# EAGLE design Screen (EAGLE 8.4.1)
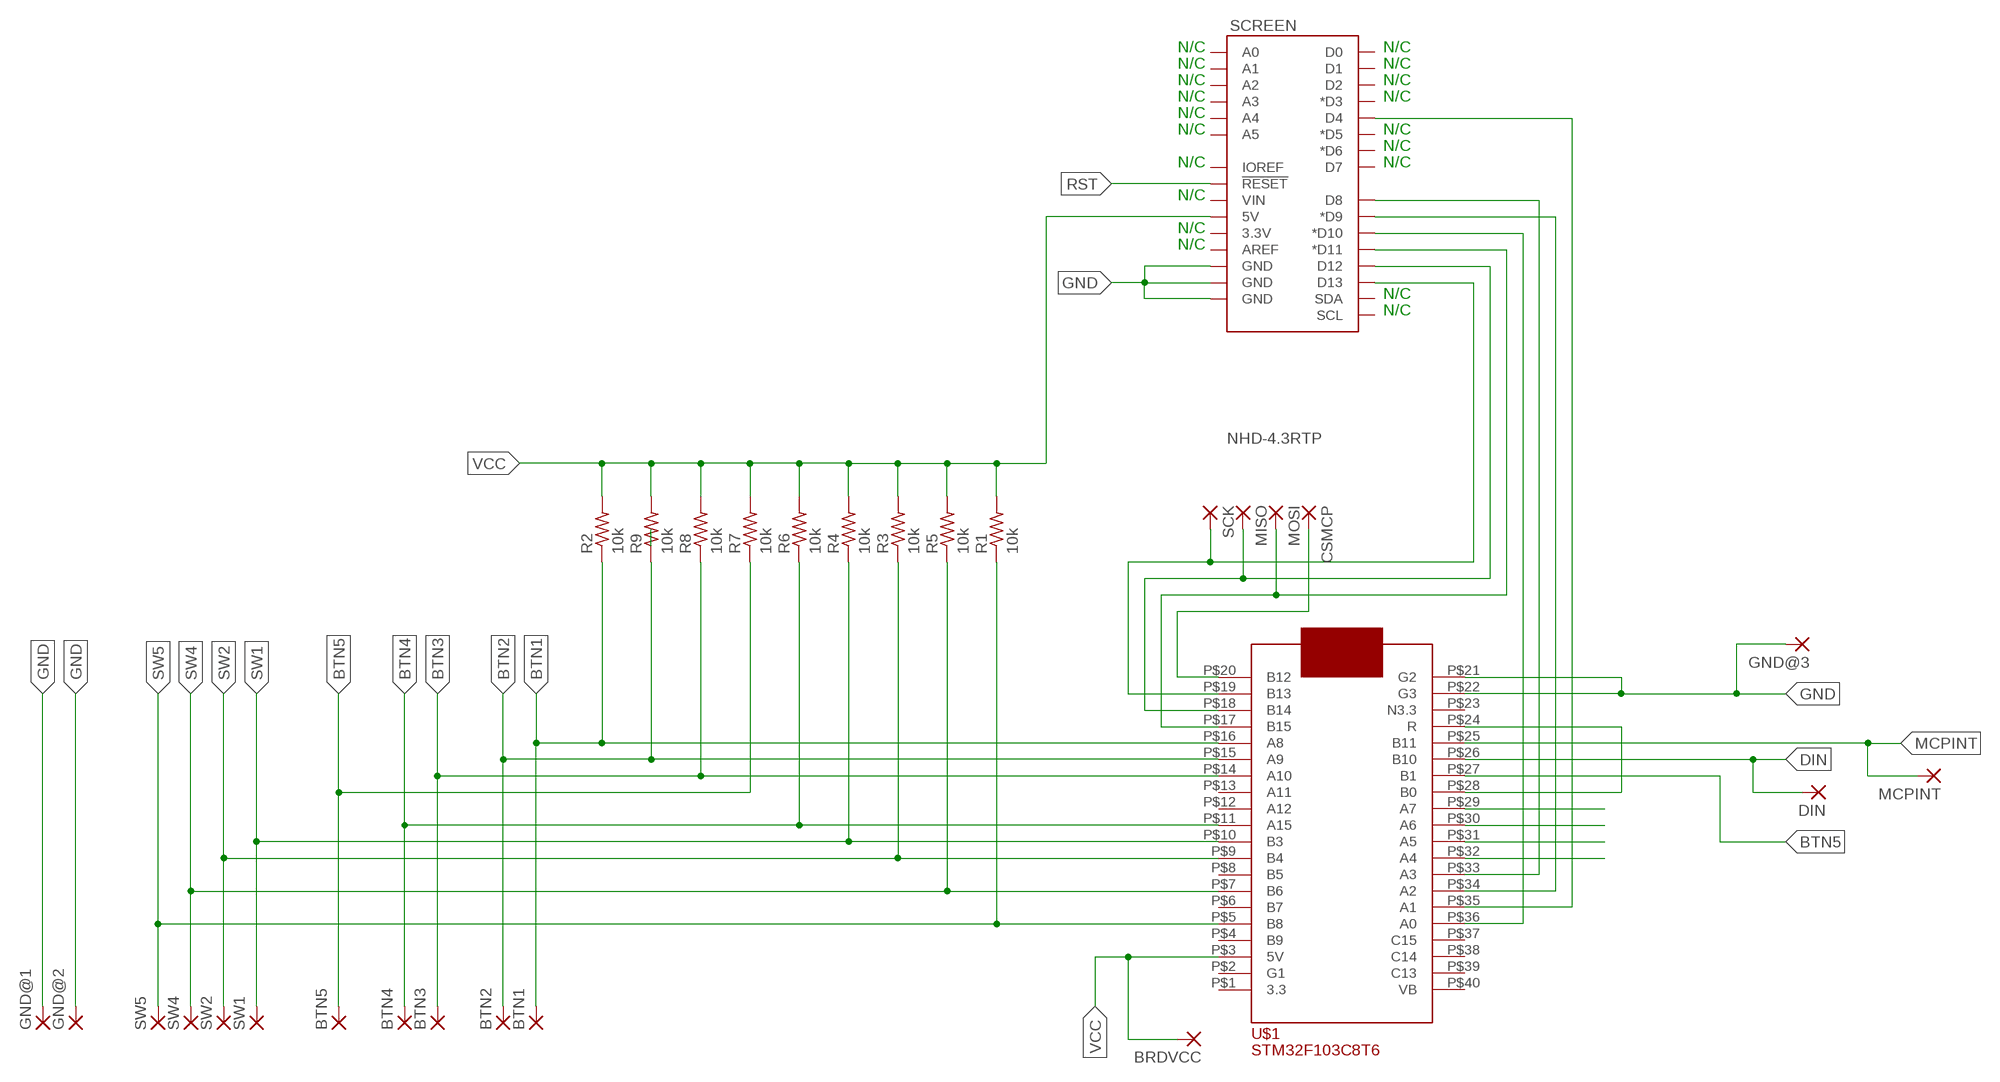
[diagram p0: schematic, sheet 1]

## Parts
BRDVCC  SMD5  [SMD2,54-5,08]
BTN1  SMD5  [SMD2,54-5,08]
BTN2  SMD5  [SMD2,54-5,08]
BTN3  SMD5  [SMD2,54-5,08]
BTN4  SMD5  [SMD2,54-5,08]
BTN5  SMD5  [SMD2,54-5,08]
CSMCP  SMD5  [SMD2,54-5,08]
DIN  SMD5  [SMD2,54-5,08]
GND@1  SMD5  [SMD2,54-5,08]
GND@2  SMD5  [SMD2,54-5,08]
GND@3  SMD5  [SMD2,54-5,08]
MCPINT  SMD5  [SMD2,54-5,08]
MISO  SMD5  [SMD2,54-5,08]
MOSI  SMD5  [SMD2,54-5,08]
R1  10k  0207/10  [0207/10]
R2  10k  0207/10  [0207/10]
R3  10k  0207/10  [0207/10]
R4  10k  0207/10  [0207/10]
R5  10k  0207/10  [0207/10]
R6  10k  0207/10  [0207/10]
R7  10k  0207/10  [0207/10]
R8  10k  0207/10  [0207/10]
R9  10k  0207/10  [0207/10]
SCK  SMD5  [SMD2,54-5,08]
SCREEN  NHD-4.3RTP  [NHD-4.3RTP]
SW1  SMD5  [SMD2,54-5,08]
SW2  SMD5  [SMD2,54-5,08]
SW4  SMD5  [SMD2,54-5,08]
SW5  SMD5  [SMD2,54-5,08]
U$1  STM32F103C8T6DIP40  [STM32]

## Nets
BTN1: BTN1.1(P) R2.1 U$1.P$16(A8)
BTN2: BTN2.1(P) R9.1 U$1.P$15(A9)
BTN3: BTN3.1(P) R8.1 U$1.P$14(A10)
BTN4: BTN4.1(P) R6.1 U$1.P$11(A15)
BTN5: BTN5.1(P) R7.1 U$1.P$27(B1)
CS_SCREEN: SCREEN.D10(*D10) U$1.P$36(A0)
CSMCP: CSMCP.1(P) U$1.P$20(B12)
DIN: DIN.1(P) U$1.P$26(B10)
GND: GND@1.1(P) GND@2.1(P) GND@3.1(P) SCREEN.GND@1(GND) SCREEN.GND@2(GND) SCREEN.GND@3(GND) U$1.P$21(G2) U$1.P$22(G3)
MCPINT: MCPINT.1(P) U$1.P$25(B11)
MISO: MISO.1(P) SCREEN.D12 U$1.P$18(B14)
MOSI: MOSI.1(P) SCREEN.D11(*D11) U$1.P$17(B15)
N$1: SCREEN.D4 U$1.P$35(A1)
N$2: SCREEN.D9(*D9) U$1.P$34(A2)
N$3: SCREEN.D8 U$1.P$33(A3)
N$9: U$1.P$29(A7)
N$10: U$1.P$30(A6)
N$11: U$1.P$31(A5)
N$12: U$1.P$32(A4)
N$13: U$1.P$24(R) U$1.P$28(B0)
RST: SCREEN.RESET@1(!RESET!)
SCK: SCK.1(P) SCREEN.D13 U$1.P$19(B13)
SW1: R4.1 SW1.1(P) U$1.P$10(B3)
SW2: R3.1 SW2.1(P) U$1.P$9(B4)
SW4: R5.1 SW4.1(P) U$1.P$7(B6)
SW5: R1.1 SW5.1(P) U$1.P$5(B8)
VCC: BRDVCC.1(P) R1.2 R2.2 R3.2 R4.2 R5.2 R6.2 R7.2 R8.2 R9.2 SCREEN.5V U$1.P$3(5V)
Unconnected: SCREEN.3.3V SCREEN.A0 SCREEN.A1 SCREEN.A2 SCREEN.A3 SCREEN.A4 SCREEN.A5 SCREEN.AREF SCREEN.D0 SCREEN.D1 SCREEN.D2 SCREEN.D3(*D3) SCREEN.D5(*D5) SCREEN.D6(*D6) SCREEN.D7 SCREEN.IOREF SCREEN.SCL SCREEN.SDA SCREEN.VIN U$1.P$1(3.3) U$1.P$2(G1) U$1.P$4(B9) U$1.P$6(B7) U$1.P$8(B5) U$1.P$12(A12) U$1.P$13(A11) U$1.P$23(N3.3) U$1.P$37(C15) U$1.P$38(C14) U$1.P$39(C13) U$1.P$40(VB)

## Notes on the sheet
- N/C | N/C
- N/C | N/C
- N/C | N/C
- N/C | N/C
- N/C
- N/C | N/C
- N/C
- N/C | N/C
- N/C
- N/C
- N/C
- N/C
- N/C

## Library data of the parts
BRDVCC BTN1-BTN5 CSMCP DIN GND@1-GND@3 MCPINT MISO MOSI SCK SW1 SW2 SW4 SW5 = wirepad:SMD5: SMD PAD
R1-R9 = Components:0207/10
SCREEN = Components:NHD-4.3RTP: Arduino R3 Footprint with SPI header Arduino Uno R3 Compatible Footprint. Matches PCB size of the original board. SparkFun Products: SAMD21 Dev Breakout <https://www.sparkfun.com/products/13672> RedBoard <https://www.sparkfun.com/products/12757> R3 Stackable Headers <https://www.sparkfun.com/products/11417>
U$1 = Components:STM32F103C8T6

## Board
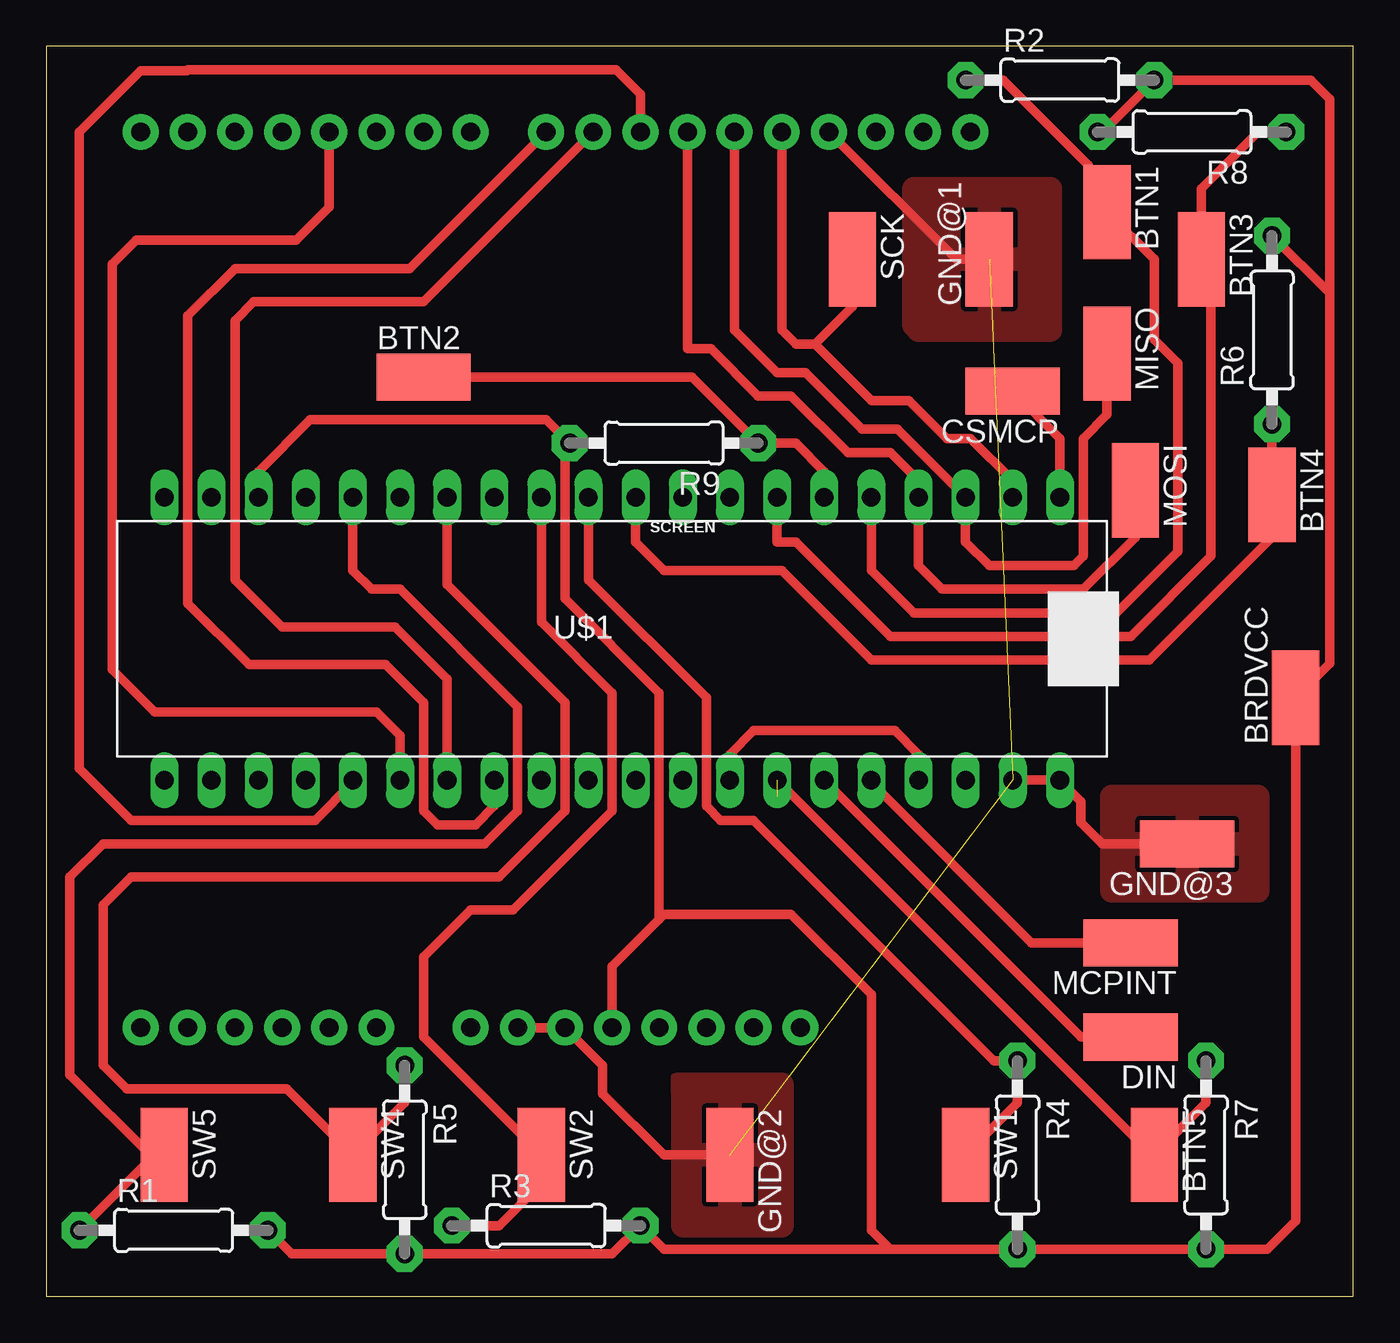
[diagram p1: board, top side]

Size 70.41 x 67.35 mm. Coordinates in mm from the lower left corner, seen from the top.
Outline: 0,0 70.41,0 70.41,67.35 0,67.35 0,0
Copper layers (1*16): Top 0.035mm / dielectric 1.5mm / Bottom 0.035mm
Design rules "default": minimum track width 16mil, minimum drill 1mm, track to track 0.25mm, track to pad 0.25mm, pad to pad 0.25mm, via to via 0.25mm, smd to smd 0mil, copper to edge 40mil, drill to drill 6mil, minimum pad ring 10mil, minimum via ring 8mil, stop-mask expansion 4mil, vias tented up to drill 0mil, thermal gap 10mil

### Footprints (pad centres in the part's own frame; a part is rotated, then mirrored left to right if it is on the bottom)
SMD2,54-5,08 = smd 2.54 x 5.08: 1 0,0
0207/10 = drill 1 pad 1.93 octagon: 1 -5.08,1.27; 2 5.08,1.27
NHD-4.3RTP = drill 1.016 pad 1.93: 3.3V 10.16,-24.13; 5V 7.62,-24.13; A0 -5.08,-24.13; A1 -7.62,-24.13; A2 -10.16,-24.13; A3 -12.7,-24.13; A4 -15.24,-24.13; A5 -17.78,-24.13; AREF 21.844,24.13; D0 -17.78,24.13; D1 -15.24,24.13; D2 -12.7,24.13; D3 -10.16,24.13; D4 -7.62,24.13; D5 -5.08,24.13; D6 -2.54,24.13; D7 0,24.13; D8 4.064,24.13; D9 6.604,24.13; D10 9.144,24.13; D11 11.684,24.13; D12 14.224,24.13; D13 16.764,24.13; GND@1 5.08,-24.13; GND@2 2.54,-24.13; GND@3 19.304,24.13; IOREF 15.24,-24.13; NC 17.78,-24.13; RESET@1 12.7,-24.13; SCL 26.924,24.13; SDA 24.384,24.13; VIN 0,-24.13
STM32 = drill 1 long: P$1 -7.62,-20.955; P$2 -7.62,-18.415; P$3 -7.62,-15.875; P$4 -7.62,-13.335; P$5 -7.62,-10.795; P$6 -7.62,-8.255; P$7 -7.62,-5.715; P$8 -7.62,-3.175; P$9 -7.62,-0.635; P$10 -7.62,1.905; P$11 -7.62,4.445; P$12 -7.62,6.985; P$13 -7.62,9.525; P$14 -7.62,12.065; P$15 -7.62,14.605; P$16 -7.62,17.145; P$17 -7.62,19.685; P$18 -7.62,22.225; P$19 -7.62,24.765; P$20 -7.62,27.305; P$21 7.62,27.305; P$22 7.62,24.765; P$23 7.62,22.225; P$24 7.62,19.685; P$25 7.62,17.145; P$26 7.62,14.605; P$27 7.62,12.065; P$28 7.62,9.525; P$29 7.62,6.985; P$30 7.62,4.445; P$31 7.62,1.905; P$32 7.62,-0.635; P$33 7.62,-3.175; P$34 7.62,-5.715; P$35 7.62,-8.255; P$36 7.62,-10.795; P$37 7.62,-13.335; P$38 7.62,-15.875; P$39 7.62,-18.415; P$40 7.62,-20.955

### Placement (x,y rotation side)
BRDVCC  67.31,32.26 0 top
BTN1  57.15,58.42 180 top
BTN2  20.32,49.53 270 top
BTN3  62.23,55.88 180 top
BTN4  66.04,43.18 180 top
BTN5  59.69,7.62 180 top
CSMCP  52.07,48.77 90 top
DIN  58.42,13.97 90 top
GND@1  50.8,55.88 0 top
GND@2  36.83,7.62 180 top
GND@3  61.47,24.38 90 top
MCPINT  58.42,19.05 90 top
MISO  57.15,50.8 180 top
MOSI  58.67,43.43 180 top
R1  6.86,2.29 0 top
R2  54.61,64.26 0 top
R3  26.92,2.54 0 top
R4  51.05,7.62 270 top
R5  18.03,7.37 270 top
R6  67.31,52.07 90 top
R7  61.21,7.62 270 top
R8  61.72,64.01 180 top
R9  33.27,47.24 180 top
SCK  43.43,55.88 180 top
SCREEN  22.86,38.61 0 top
SW1  49.53,7.62 180 top
SW2  26.67,7.62 180 top
SW4  16.51,7.62 180 top
SW5  6.35,7.62 180 top
U$1  27.3,35.43 270 top

### Tracks (layer width: path | path; a pad name or v marks a point on that pad's centre or on a via)
BTN1
  Top 0.508: U$1.P$16 44.45,39.12 46.74,36.83 57.66,36.83 60.96,40.13 60.96,50.29 59.69,51.56 59.69,55.88 BTN1.1 56.13,59.44 56.13,60.96 51.56,65.53 R2.1
BTN2
  Top 0.508: BTN2.1 34.8,49.53 R9.1 40.39,45.97 41.91,44.45 U$1.P$15
BTN3
  Top 0.508: U$1.P$14 39.37,40.64 40.39,40.64 45.47,35.56 58.42,35.56 62.74,39.88 62.74,55.37 BTN3.1 62.23,59.69 65.28,62.74 R8.1
BTN4
  Top 0.508: U$1.P$11 31.75,40.64 33.27,39.12 39.62,39.12 44.45,34.29 59.44,34.29 66.04,40.89 BTN4.1 R6.1
BTN5  (1 unrouted)
  Top 0.508: R7.1 62.48,10.41 BTN5.1 59.56,7.62 U$1.P$27
CS_SCREEN
  Top 0.508: SCREEN.D10 32,64.77 30.69,66.08 7.62,66.08 7.58,66.04 5.08,66.04 1.78,62.74 1.78,28.45 4.57,25.65 14.48,25.65 16.51,27.69 U$1.P$36
CSMCP
  Top 0.508: CSMCP.1 54.61,46.23 U$1.P$20
DIN
  Top 0.508: U$1.P$26 55.75,13.97 DIN.1
GND  (2 unrouted)
  Top 0.508: SCREEN.GND@2 SCREEN.GND@1 29.97,12.45 29.97,10.92 33.27,7.62 GND@2.1 | U$1.P$22 U$1.P$21 55.75,26.67 55.75,25.53 56.9,24.38 GND@3.1 | SCREEN.GND@3 49.02,55.88 GND@1.1
  pour Top: 46.74,59.69 54.1,59.69 54.1,52.07 46.99,52.07 46.74,52.32
  pour Top: 34.04,11.43 39.62,11.43 39.62,3.81 34.29,3.81 34.29,11.18
  pour Top: 57.4,26.92 65.28,26.92 65.28,21.84 57.4,21.84
MCPINT
  Top 0.508: U$1.P$25 44.45,27.69 53.09,19.05 MCPINT.1
MISO
  Top 0.508: SCREEN.D12 37.08,52.07 39.37,49.78 40.89,49.78 43.94,46.74 45.85,46.74 U$1.P$18 49.53,40.64 50.8,39.37 55.37,39.37 55.88,39.88 55.88,46.23 57.15,47.5 MISO.1
MOSI
  Top 0.508: SCREEN.D11 34.54,51.05 35.81,51.05 38.35,48.51 40.13,48.51 43.18,45.47 45.47,45.47 46.99,43.94 U$1.P$17 46.99,39.37 48.26,38.1 55.88,38.1 58.67,40.89 MOSI.1
N$1
  Top 0.508: SCREEN.D4 15.24,58.67 13.46,56.9 4.83,56.9 3.56,55.63 3.56,33.78 5.84,31.5 17.78,31.5 19.05,30.23 U$1.P$35
N$2
  Top 0.508: SCREEN.D9 20.32,53.59 11.18,53.59 10.16,52.58 10.16,38.61 12.7,36.07 18.8,36.07 21.59,33.27 U$1.P$34
N$3
  Top 0.508: SCREEN.D8 19.56,55.37 10.41,55.37 | 10.41,55.37 10.16,55.37 | U$1.P$33 24.13,26.42 23.11,25.4 21.08,25.4 20.32,26.16 20.32,32 18.29,34.04 10.92,34.04 7.62,37.34 7.62,52.83 10.16,55.37 | 10.16,55.37 10.41,55.37
N$13
  Top 0.508: U$1.P$28 36.83,29.21 38.1,30.48 45.72,30.48 46.99,29.21 U$1.P$24
SCK
  Top 0.508: U$1.P$19 52.07,43.94 49.78,46.23 48.51,46.23 46.48,48.26 44.45,48.26 41.4,51.31 | SCREEN.D13 39.62,52.07 40.39,51.31 41.4,51.31 | SCK.1 43.43,53.34 41.4,51.31
SW1
  Top 0.508: U$1.P$10 29.21,38.61 35.56,32.26 35.56,26.42 36.32,25.65 38.1,25.65 51.05,12.7 R4.1 52.32,10.41 SW1.1
SW2
  Top 0.508: U$1.P$9 26.67,36.32 30.48,32.51 30.48,26.16 25.15,20.83 22.86,20.83 20.32,18.29 20.32,13.97 SW2.1 26.67,6.1 24.38,3.81 R3.1
SW4
  Top 0.508: SW4.1 17.53,7.62 | SW4.1 12.95,11.18 4.32,11.18 3.05,12.45 3.05,21.08 4.57,22.61 24.38,22.61 27.94,26.16 27.94,32 21.59,38.35 U$1.P$7 | R5.1 19.3,10.41 SW4.1
SW5
  Top 0.508: U$1.P$5 16.51,39.12 17.53,38.1 19.05,38.1 25.4,31.75 25.4,26.16 23.62,24.38 3.05,24.38 1.27,22.61 1.27,11.94 5.59,7.62 SW5.1 5.84,7.62 R1.1
VCC
  Top 0.508: SCREEN.5V 30.48,17.78 33.02,20.32 | 33.02,20.32 33.27,20.57 40.13,20.57 44.45,16.26 44.45,3.56 45.47,2.54 | 33.02,20.32 33.02,32.51 27.94,37.59 27.94,45.72 R9.2 26.92,47.24 14.22,47.24 11.43,44.45 U$1.P$3 | 69.14,54.05 69.14,34.09 BRDVCC.1 67.31,4.06 65.79,2.54 R7.2 R4.2 45.47,2.54 | 69.14,54.05 69.14,64.52 68.12,65.53 R2.2 56.9,62.74 R8.2 | R6.2 69.14,54.05 | 45.47,2.54 33.27,2.54 R3.2 30.48,2.29 R5.2 13.21,2.29 R1.2